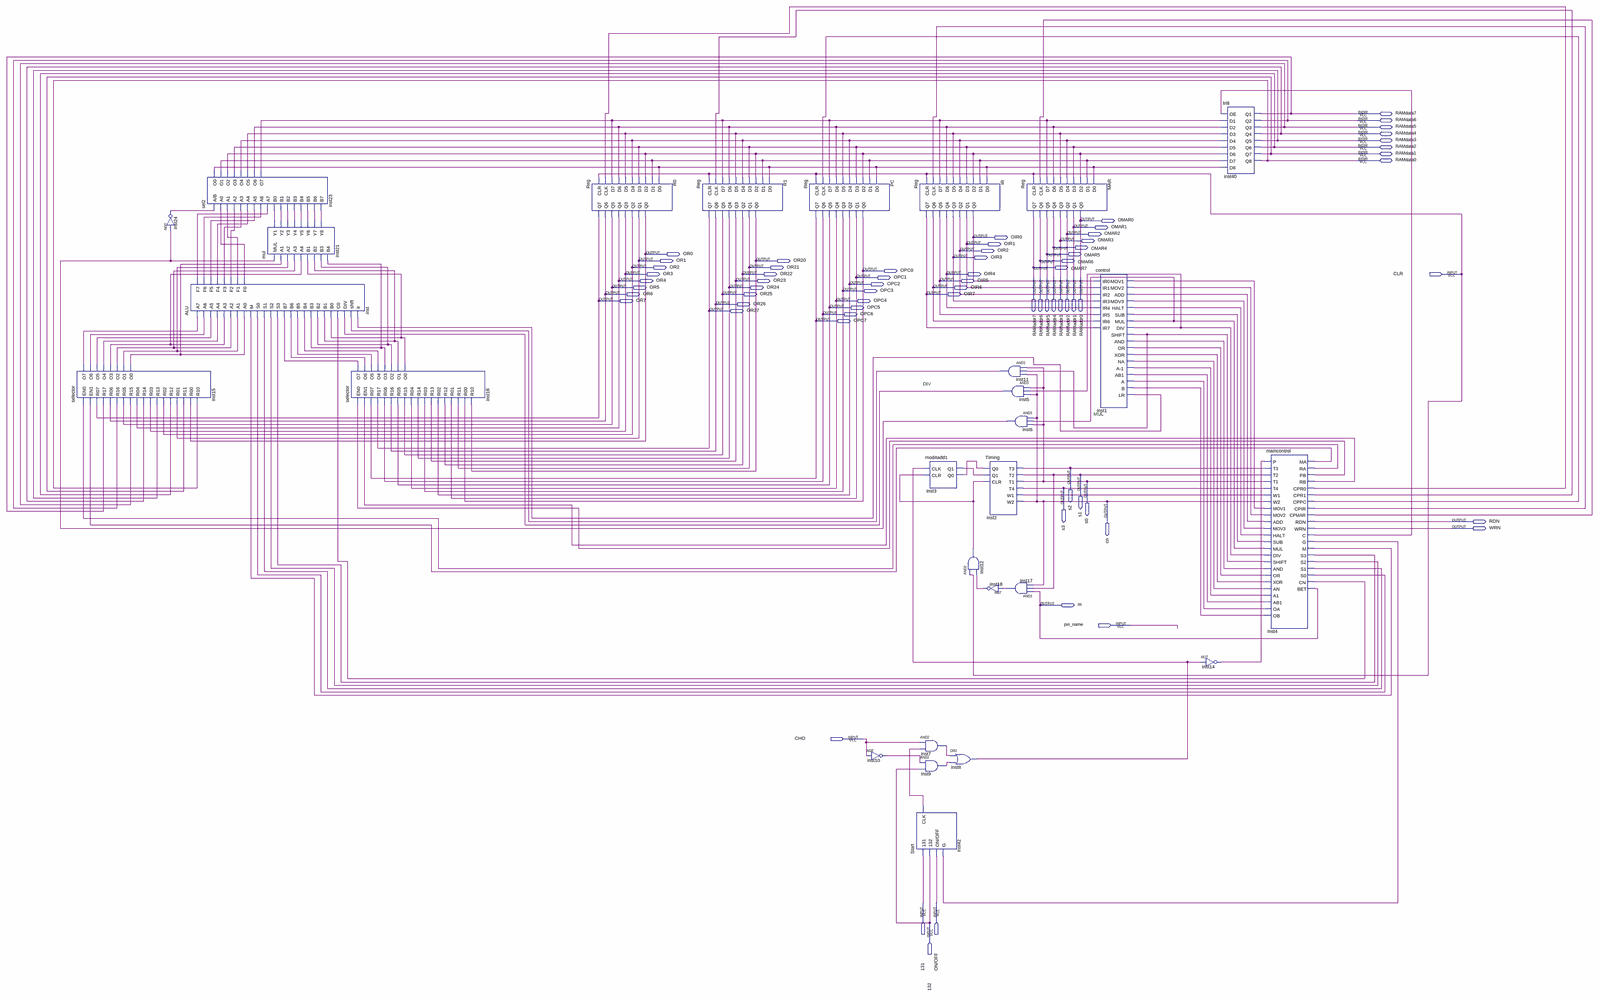
[diagram p0: schematic sheet, whole]
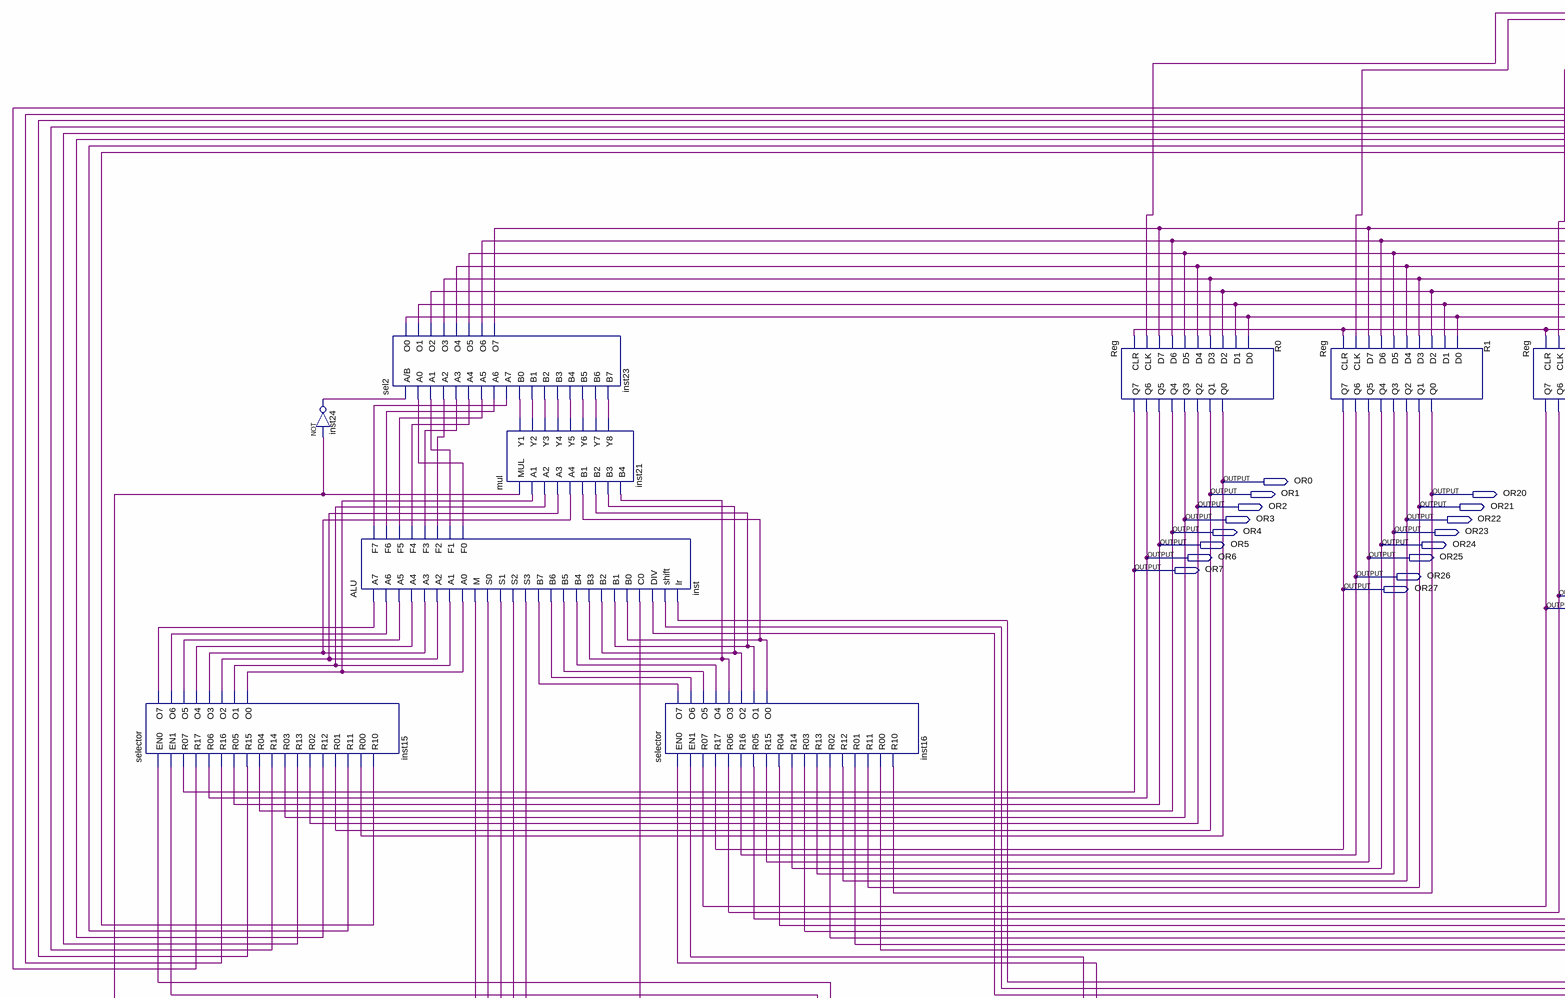
[diagram p1: schematic sheet, upper left part]
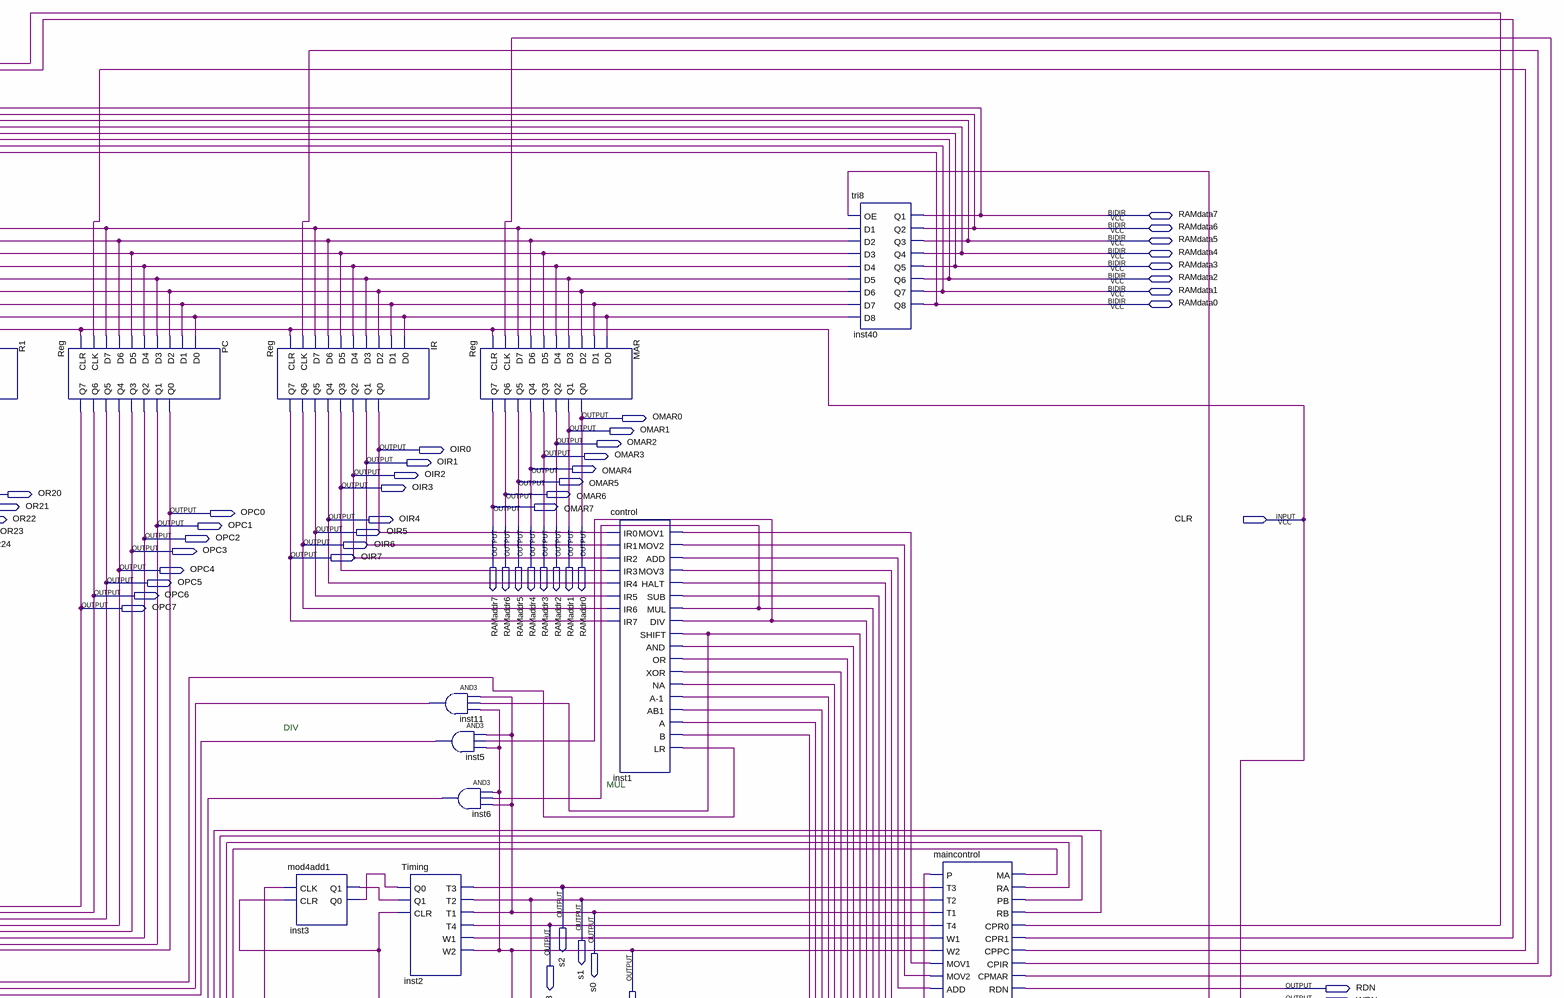
[diagram p2: schematic sheet, upper right part]
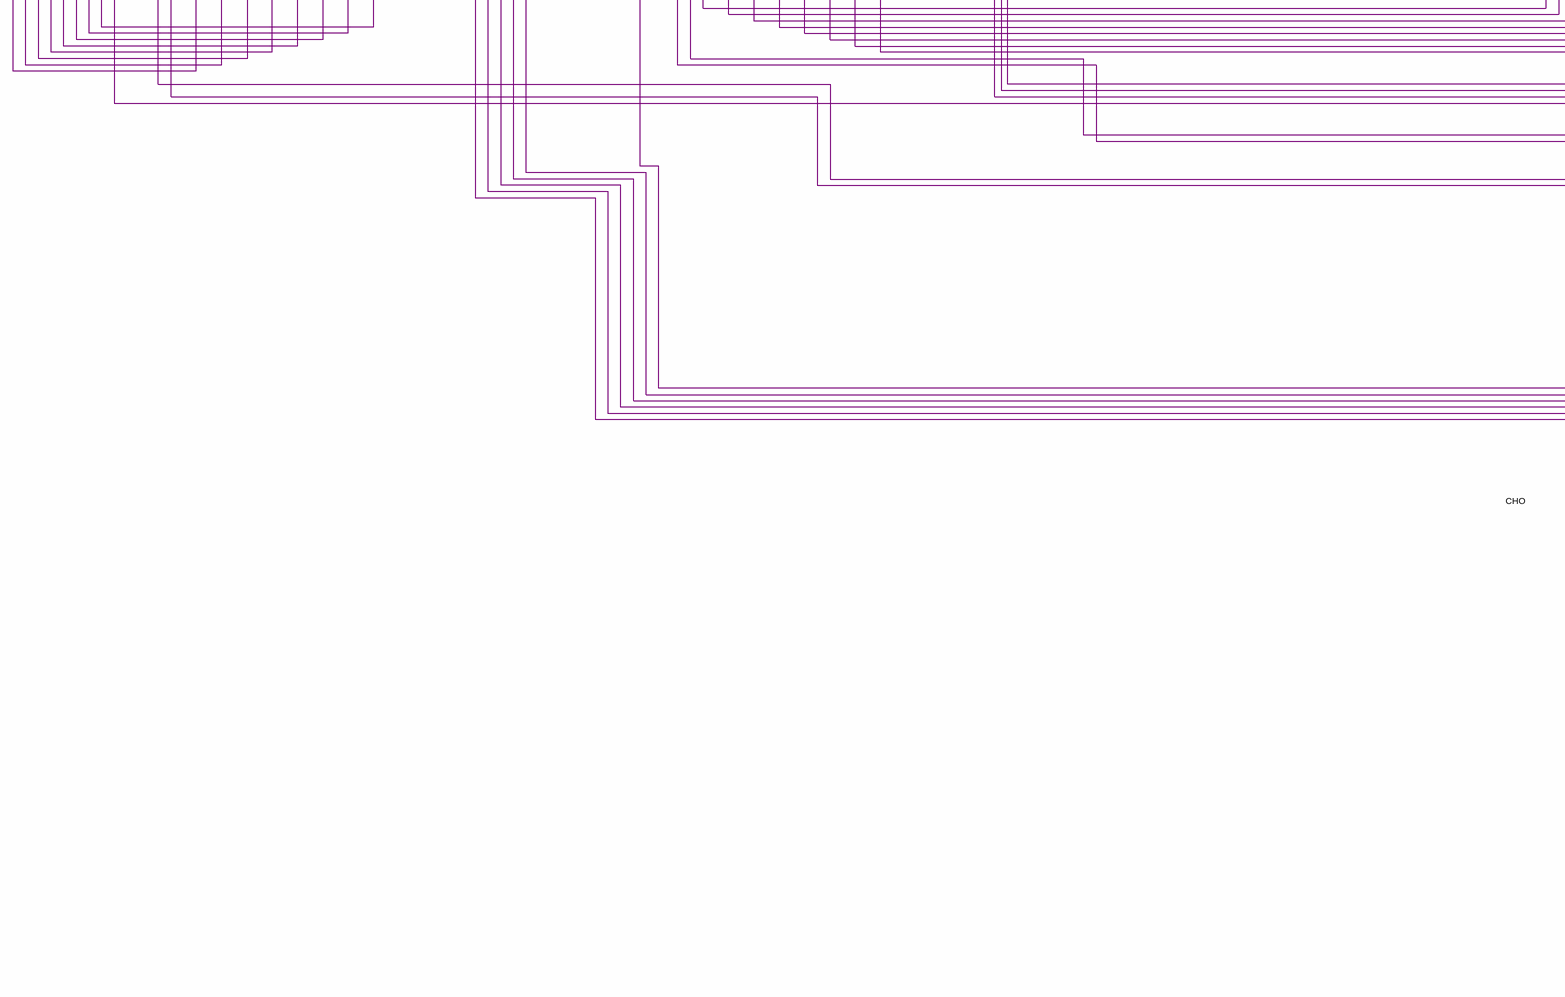
[diagram p3: schematic sheet, lower left part]
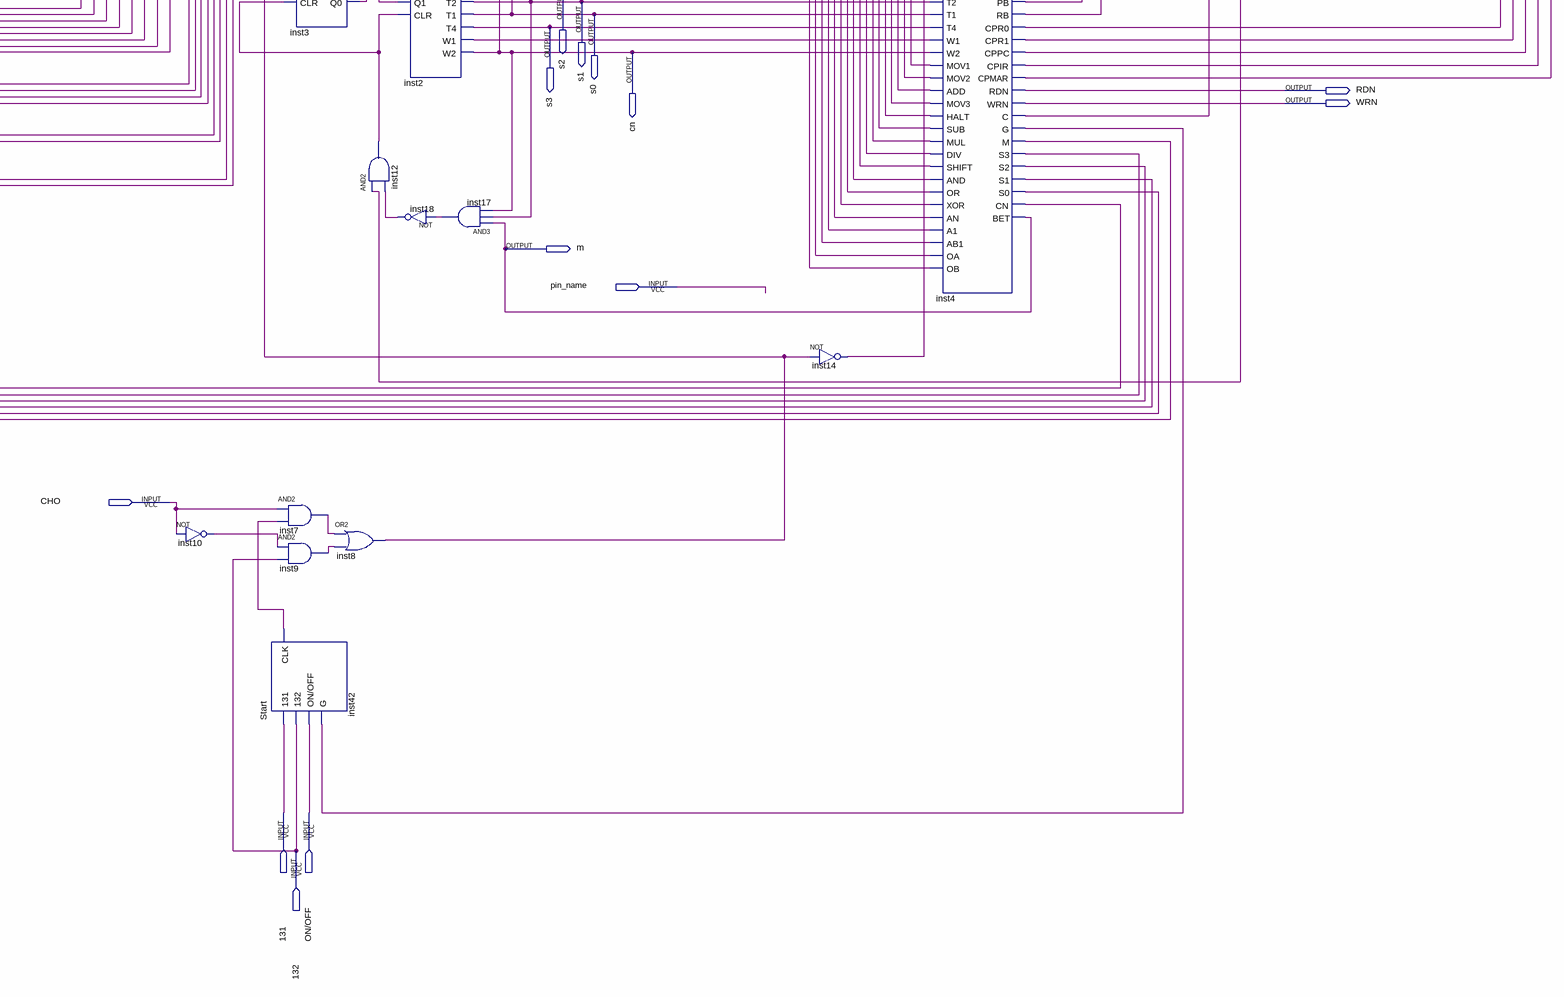
[diagram p4: schematic sheet, lower right part]
// Quartus schematic EXP4.bdf as structural Verilog: 28 symbols, 70 pins
module EXP4 (
  input  CLR,
  input  pin_name,
  input  CHO,
  input  \131 ,
  input  \ON/OFF ,
  input  \132 ,
  inout  RAMdata7,
  inout  RAMdata6,
  inout  RAMdata5,
  inout  RAMdata4,
  inout  RAMdata3,
  inout  RAMdata2,
  inout  RAMdata1,
  inout  RAMdata0,
  output OMAR0,
  output OMAR1,
  output OMAR2,
  output OIR0,
  output OMAR3,
  output OIR1,
  output OMAR4,
  output OIR2,
  output OR0,
  output OMAR5,
  output OIR3,
  output OR1,
  output OR20,
  output OMAR6,
  output OR2,
  output OR21,
  output OMAR7,
  output OPC0,
  output OR3,
  output OR22,
  output OIR4,
  output OPC1,
  output RAMaddr7,
  output RAMaddr6,
  output RAMaddr5,
  output RAMaddr4,
  output RAMaddr3,
  output RAMaddr2,
  output RAMaddr1,
  output RAMaddr0,
  output OR4,
  output OR23,
  output OIR5,
  output OPC2,
  output OR5,
  output OR24,
  output OIR6,
  output OPC3,
  output OR6,
  output OR25,
  output OIR7,
  output OR7,
  output OPC4,
  output OR26,
  output OPC5,
  output OR27,
  output OPC6,
  output OPC7,
  output s2,
  output s1,
  output s0,
  output s3,
  output cn,
  output RDN,
  output WRN,
  output m
);

  wire inst1_a, inst1_a_1, inst1_ab1, inst1_add, inst1_and, inst1_b, inst1_div, inst1_halt, inst1_lr,
       inst1_mov1, inst1_mov2, inst1_mov3, inst1_mul, inst1_na, inst1_or, inst1_shift, inst1_sub, inst1_xor,
       inst2_w1, inst3_q0, inst3_q1, inst4_c, inst4_cn, inst4_cpir, inst4_cpmar, inst4_cppc, inst4_cpr0,
       inst4_cpr1, inst4_g, inst4_m, inst4_ma, inst4_pb, inst4_ra, inst4_rb, inst4_s0, inst4_s1, inst4_s2,
       inst4_s3, inst5_out, inst6_out, inst7_out, inst8_out, inst9_out, inst10_out, inst11_out, inst12_out,
       inst14_out, inst15_o0, inst15_o1, inst15_o2, inst15_o3, inst15_o4, inst15_o5, inst15_o6, inst15_o7,
       inst16_o0, inst16_o1, inst16_o2, inst16_o3, inst16_o4, inst16_o5, inst16_o6, inst16_o7, inst17_out,
       inst18_out, inst21_y1, inst21_y2, inst21_y3, inst21_y4, inst21_y5, inst21_y6, inst21_y7, inst21_y8,
       inst23_o0, inst23_o1, inst23_o2, inst23_o3, inst23_o4, inst23_o5, inst23_o6, inst23_o7, inst24_out,
       inst42_clk, inst_f0, inst_f1, inst_f2, inst_f3, inst_f4, inst_f5, inst_f6, inst_f7;

  selector inst15 (
    .EN0(inst4_ra), .EN1(inst4_ma), .R07(OR7), .R17(RAMdata7), .R06(OR6), .R16(RAMdata6), .R05(OR5),
    .R15(RAMdata5), .R04(OR4), .R14(RAMdata4), .R03(OR3), .R13(RAMdata3), .R02(OR2), .R12(RAMdata2),
    .R01(OR1), .R11(RAMdata1), .R00(OR0), .R10(RAMdata0), .O7(inst15_o7), .O6(inst15_o6), .O5(inst15_o5),
    .O4(inst15_o4), .O3(inst15_o3), .O2(inst15_o2), .O1(inst15_o1), .O0(inst15_o0));
  not inst24 (inst24_out, inst6_out);
  ALU inst (
    .A7(inst15_o7), .A6(inst15_o6), .A5(inst15_o5), .A4(inst15_o4), .A3(inst15_o3), .A2(inst15_o2),
    .A1(inst15_o1), .A0(inst15_o0), .M(inst4_m), .S0(inst4_s0), .S1(inst4_s1), .S2(inst4_s2), .S3(inst4_s3),
    .B7(inst16_o7), .B6(inst16_o6), .B5(inst16_o5), .B4(inst16_o4), .B3(inst16_o3), .B2(inst16_o2),
    .B1(inst16_o1), .B0(inst16_o0), .C0(inst4_cn), .DIV(inst5_out), .shift(inst11_out), .lr(inst1_lr),
    .F7(inst_f7), .F6(inst_f6), .F5(inst_f5), .F4(inst_f4), .F3(inst_f3), .F2(inst_f2), .F1(inst_f1),
    .F0(inst_f0));
  sel2 inst23 (
    .\A/B (inst24_out), .A0(inst_f0), .A1(inst_f1), .A2(inst_f2), .A3(inst_f3), .A4(inst_f4), .A5(inst_f5),
    .A6(inst_f6), .A7(inst_f7), .B0(inst21_y1), .B1(inst21_y2), .B2(inst21_y3), .B3(inst21_y4),
    .B4(inst21_y5), .B5(inst21_y6), .B6(inst21_y7), .B7(inst21_y8), .O0(inst23_o0), .O1(inst23_o1),
    .O2(inst23_o2), .O3(inst23_o3), .O4(inst23_o4), .O5(inst23_o5), .O6(inst23_o6), .O7(inst23_o7));
  mul inst21 (
    .MUL(inst6_out), .A1(inst15_o0), .A2(inst15_o1), .A3(inst15_o2), .A4(inst15_o3), .B1(inst16_o0),
    .B2(inst16_o1), .B3(inst16_o2), .B4(inst16_o3), .Y1(inst21_y1), .Y2(inst21_y2), .Y3(inst21_y3),
    .Y4(inst21_y4), .Y5(inst21_y5), .Y6(inst21_y6), .Y7(inst21_y7), .Y8(inst21_y8));
  selector inst16 (
    .EN0(inst4_pb), .EN1(inst4_rb), .R07(OPC7), .R17(OR27), .R06(OPC6), .R16(OR26), .R05(OPC5), .R15(OR25),
    .R04(OPC4), .R14(OR24), .R03(OPC3), .R13(OR23), .R02(OPC2), .R12(OR22), .R01(OPC1), .R11(OR21),
    .R00(OPC0), .R10(OR20), .O7(inst16_o7), .O6(inst16_o6), .O5(inst16_o5), .O4(inst16_o4), .O3(inst16_o3),
    .O2(inst16_o2), .O1(inst16_o1), .O0(inst16_o0));
  Reg R0 (
    .CLR(CLR), .CLK(inst4_cpr0), .D7(inst23_o7), .D6(inst23_o6), .D5(inst23_o5), .D4(inst23_o4),
    .D3(inst23_o3), .D2(inst23_o2), .D1(inst23_o1), .D0(inst23_o0), .Q7(OR7), .Q6(OR6), .Q5(OR5), .Q4(OR4),
    .Q3(OR3), .Q2(OR2), .Q1(OR1), .Q0(OR0));
  Reg R1 (
    .CLR(CLR), .CLK(inst4_cpr1), .D7(inst23_o7), .D6(inst23_o6), .D5(inst23_o5), .D4(inst23_o4),
    .D3(inst23_o3), .D2(inst23_o2), .D1(inst23_o1), .D0(inst23_o0), .Q7(OR27), .Q6(OR26), .Q5(OR25),
    .Q4(OR24), .Q3(OR23), .Q2(OR22), .Q1(OR21), .Q0(OR20));
  Reg PC (
    .CLR(CLR), .CLK(inst4_cppc), .D7(inst23_o7), .D6(inst23_o6), .D5(inst23_o5), .D4(inst23_o4),
    .D3(inst23_o3), .D2(inst23_o2), .D1(inst23_o1), .D0(inst23_o0), .Q7(OPC7), .Q6(OPC6), .Q5(OPC5),
    .Q4(OPC4), .Q3(OPC3), .Q2(OPC2), .Q1(OPC1), .Q0(OPC0));
  not inst10 (inst10_out, CHO);
  Reg IR (
    .CLR(CLR), .CLK(inst4_cpir), .D7(inst23_o7), .D6(inst23_o6), .D5(inst23_o5), .D4(inst23_o4),
    .D3(inst23_o3), .D2(inst23_o2), .D1(inst23_o1), .D0(inst23_o0), .Q7(OIR7), .Q6(OIR6), .Q5(OIR5),
    .Q4(OIR4), .Q3(OIR3), .Q2(OIR2), .Q1(OIR1), .Q0(OIR0));
  Start inst42 (.\131 (\131 ), .\132 (\132 ), .\ON/OFF (\ON/OFF ), .G(inst4_g), .CLK(inst42_clk));
  mod4add1 inst3 (.CLK(inst8_out), .CLR(inst12_out), .Q1(inst3_q1), .Q0(inst3_q0));
  and inst7 (inst7_out, CHO, inst42_clk);
  and inst9 (inst9_out, inst10_out, \132 );
  and inst12 (inst12_out, CLR, inst18_out);
  or inst8 (inst8_out, inst7_out, inst9_out);
  Timing inst2 (
    .Q0(inst3_q0), .Q1(inst3_q1), .CLR(inst12_out), .T3(s2), .T2(s1), .T1(s0), .T4(s3), .W1(inst2_w1), .W2(cn));
  not inst18 (inst18_out, inst17_out);
  Reg MAR (
    .CLR(CLR), .CLK(inst4_cpmar), .D7(inst23_o7), .D6(inst23_o6), .D5(inst23_o5), .D4(inst23_o4),
    .D3(inst23_o3), .D2(inst23_o2), .D1(inst23_o1), .D0(inst23_o0), .Q7(OMAR7), .Q6(OMAR6), .Q5(OMAR5),
    .Q4(OMAR4), .Q3(OMAR3), .Q2(OMAR2), .Q1(OMAR1), .Q0(OMAR0));
  and inst11 (inst11_out, s0, inst1_shift, cn);
  and inst5 (inst5_out, s0, inst1_div, cn);
  and inst6 (inst6_out, cn, inst1_mul, s0);
  and inst17 (inst17_out, m, s1, cn);
  control inst1 (
    .IR0(OIR0), .IR1(OIR1), .IR2(OIR2), .IR3(OIR3), .IR4(OIR4), .IR5(OIR5), .IR6(OIR6), .IR7(OIR7),
    .MOV1(inst1_mov1), .MOV2(inst1_mov2), .ADD(inst1_add), .MOV3(inst1_mov3), .HALT(inst1_halt),
    .SUB(inst1_sub), .MUL(inst1_mul), .DIV(inst1_div), .SHIFT(inst1_shift), .AND(inst1_and), .OR(inst1_or),
    .XOR(inst1_xor), .NA(inst1_na), .\A-1 (inst1_a_1), .AB1(inst1_ab1), .A(inst1_a), .B(inst1_b),
    .LR(inst1_lr));
  not inst14 (inst14_out, inst8_out);
  tri8 inst40 (
    .OE(inst4_c), .D1(inst23_o7), .D2(inst23_o6), .D3(inst23_o5), .D4(inst23_o4), .D5(inst23_o3),
    .D6(inst23_o2), .D7(inst23_o1), .D8(inst23_o0), .Q1(RAMdata7), .Q2(RAMdata6), .Q3(RAMdata5),
    .Q4(RAMdata4), .Q5(RAMdata3), .Q6(RAMdata2), .Q7(RAMdata1), .Q8(RAMdata0));
  maincontrol inst4 (
    .P(inst14_out), .T3(s2), .T2(s1), .T1(s0), .T4(s3), .W1(inst2_w1), .W2(cn), .MOV1(inst1_mov1),
    .MOV2(inst1_mov2), .ADD(inst1_add), .MOV3(inst1_mov3), .HALT(inst1_halt), .SUB(inst1_sub),
    .MUL(inst1_mul), .DIV(inst1_div), .SHIFT(inst1_shift), .AND(inst1_and), .OR(inst1_or), .XOR(inst1_xor),
    .AN(inst1_na), .A1(inst1_a_1), .AB1(inst1_ab1), .OA(inst1_a), .OB(inst1_b), .MA(inst4_ma), .RA(inst4_ra),
    .PB(inst4_pb), .RB(inst4_rb), .CPR0(inst4_cpr0), .CPR1(inst4_cpr1), .CPPC(inst4_cppc), .CPIR(inst4_cpir),
    .CPMAR(inst4_cpmar), .RDN(RDN), .WRN(WRN), .C(inst4_c), .G(inst4_g), .M(inst4_m), .S3(inst4_s3),
    .S2(inst4_s2), .S1(inst4_s1), .S0(inst4_s0), .CN(inst4_cn), .BET(m));

  assign RAMaddr0 = OMAR0;
  assign RAMaddr1 = OMAR1;
  assign RAMaddr2 = OMAR2;
  assign RAMaddr3 = OMAR3;
  assign RAMaddr4 = OMAR4;
  assign RAMaddr5 = OMAR5;
  assign RAMaddr6 = OMAR6;
  assign RAMaddr7 = OMAR7;

  // Notes on the sheet:
  //   DIV
  //   MUL
endmodule
